# EasyEDA schematic SCH_Iris_OnBoardSystem.json
TITLE: On Board Controller w/ all Arduino Pins Exposed; REV: 1.4; Date: 2023-06-11; Sheet: 1/2; Drawn By: markos.delaportas; Company: ASPiRE
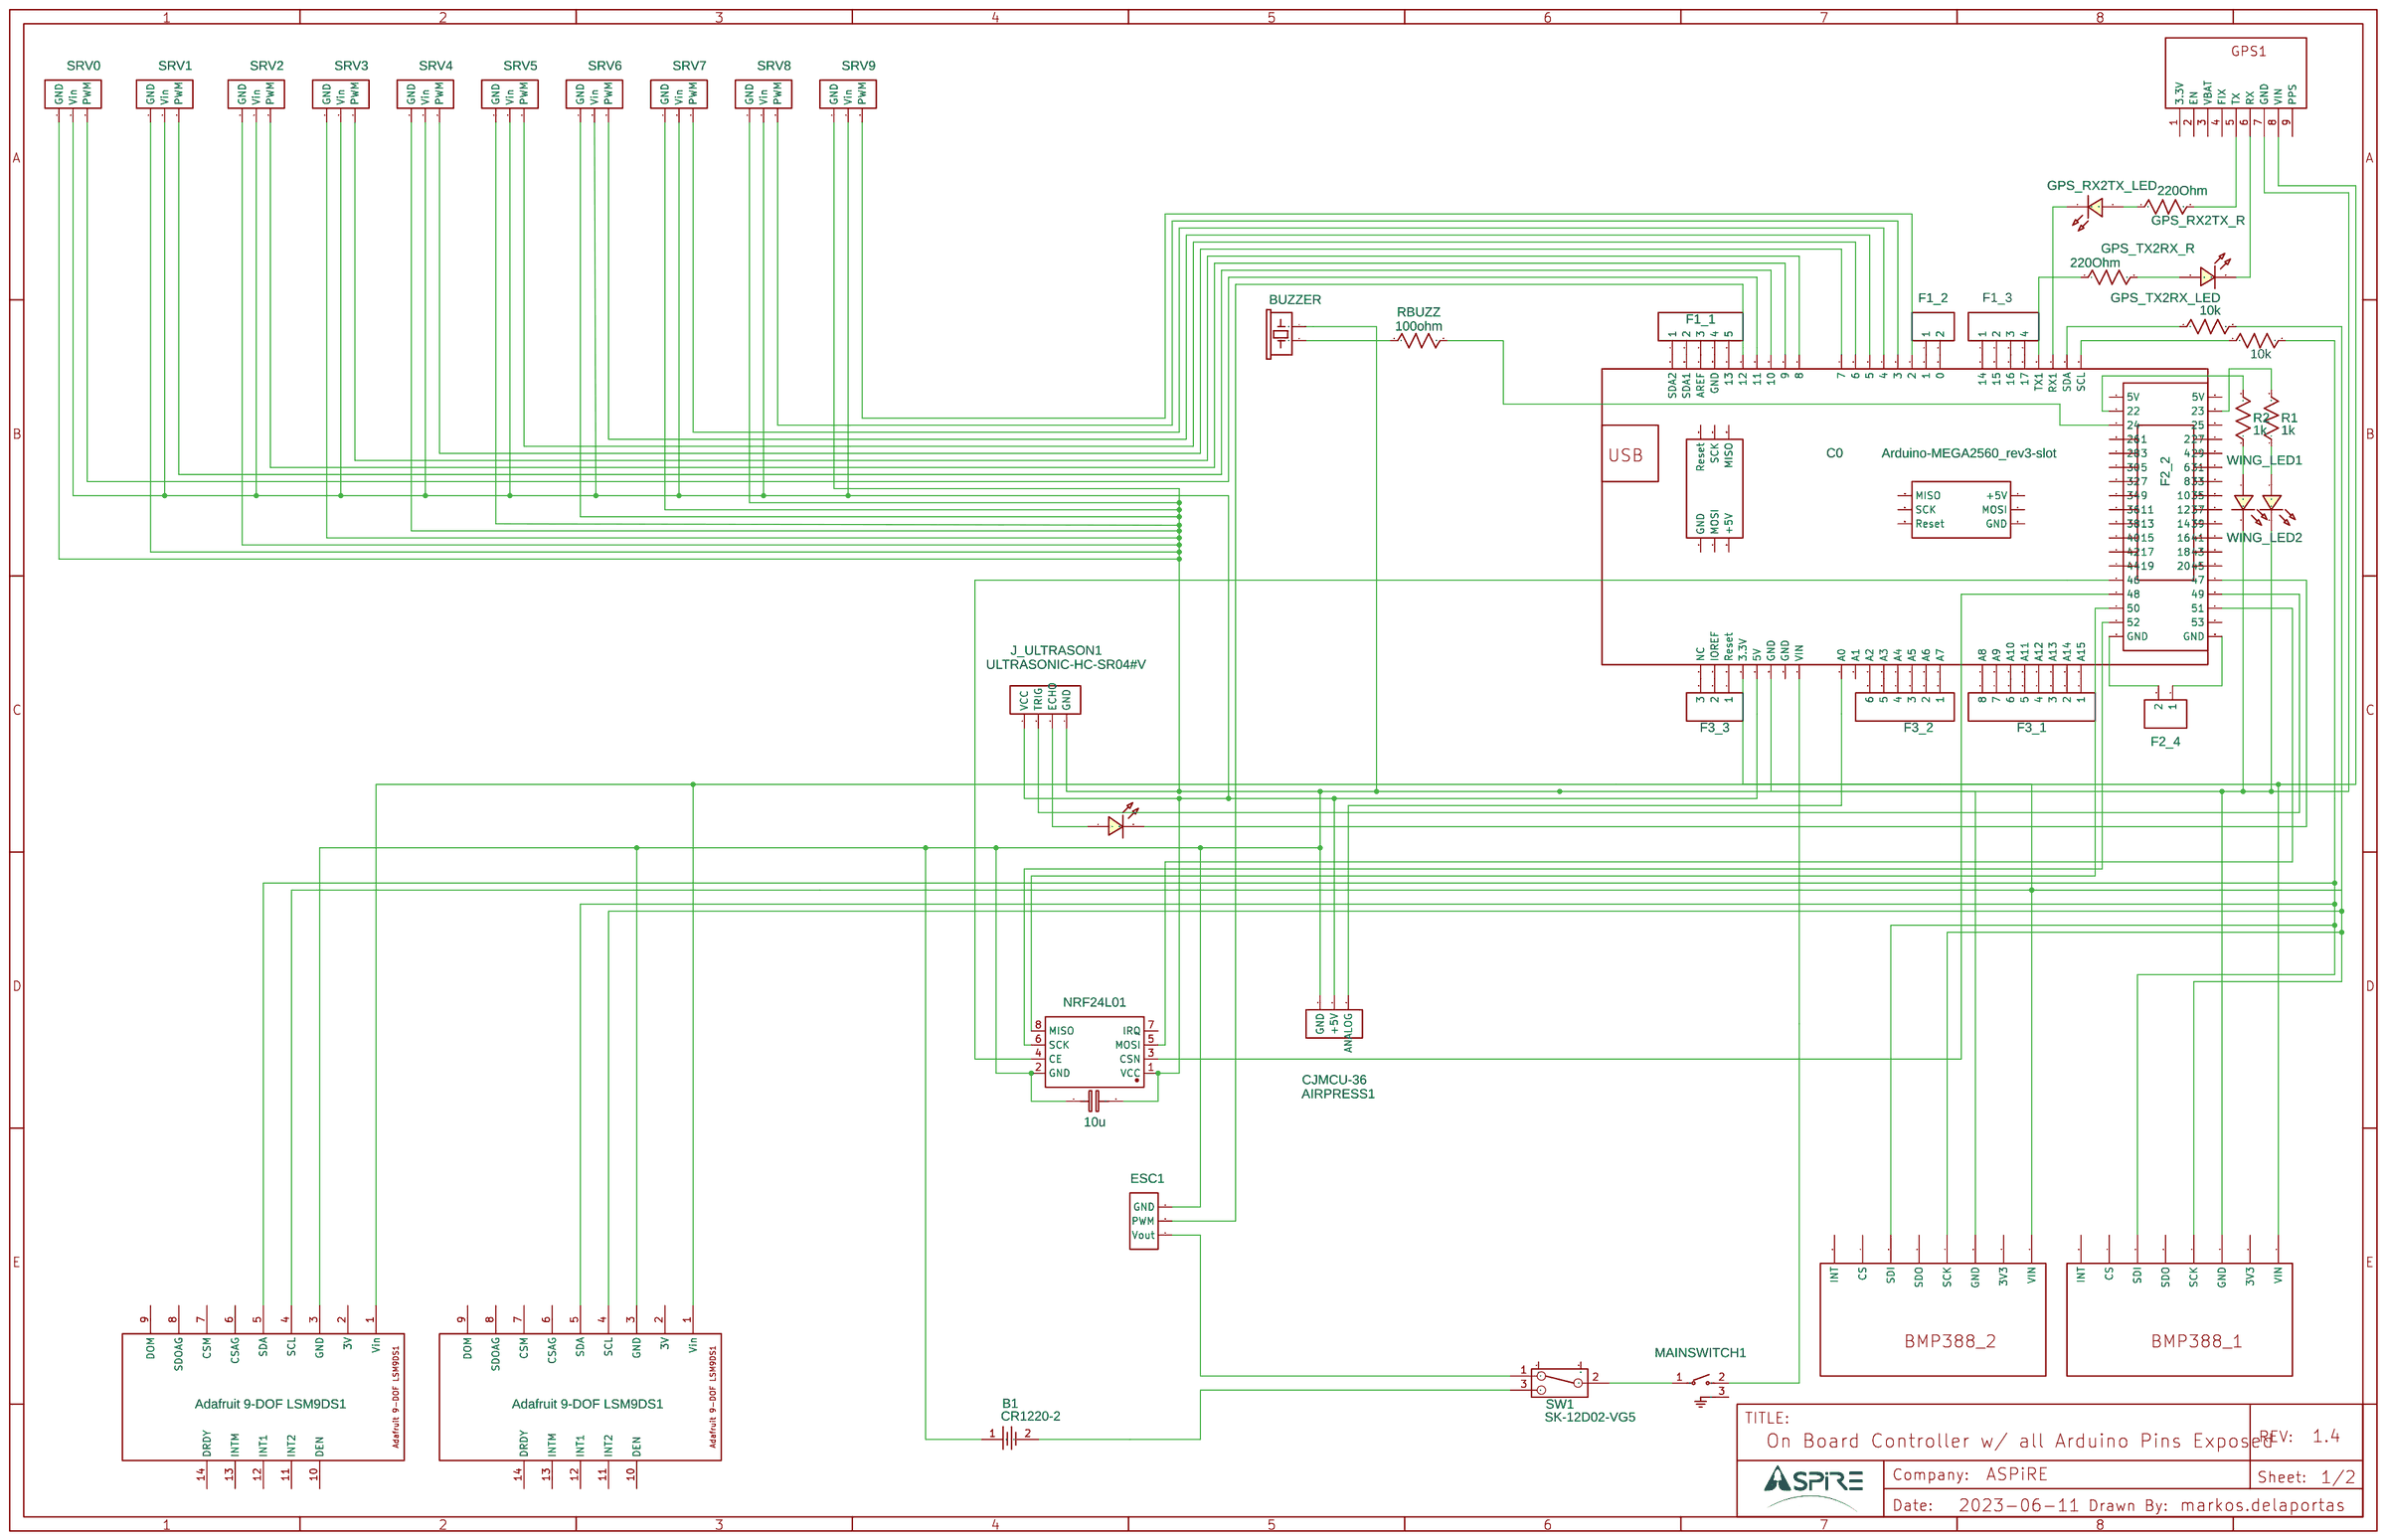
[diagram p0: schematic sheet]

## Parts
AIRPRESS1  CJMCU-36  [HDR-M-2.54_1X3]
B1  CR1220-2  [BAT-SMD_CR1220-2]
BUZZER  BUZZER-PTH_NO_SILK  [BUZZER-12MM-NS]
C0  Arduino-MEGA2560_rev3-slot  [ARDUINO-MEGA2560_REV3-SLOT-FOOTPRINT]
C1_2  10u  [RAD-0.1]
ESC1  ESC  [HDR-M-2.54_1X3]
F1_1  HDR-F-2.54_1x5  [HDR-F-2.54_1X5]
F1_2  HDR-F-2.54_1x2  [HDR-F-2.54_1X2]
F1_3  HDR-F-2.54_1x4  [HDR-F-2.54_1X4]
F2_2  HDR-F-2.54_2x10  [HDR-F-2.54_2X10]
F2_4  HDR-F-2.54_1x2  [HDR-F-2.54_1X2]
F3_1  HDR-F-2.54_1x8  [HDR-F-2.54_1X8]
F3_2  HDR-F-2.54_1x6  [HDR-F-2.54_1X6]
F3_3  HDR-F-2.54_1x3  [HDR-F-2.54_1X3]
GPS2  ULTIMATE GPS MODULE  [ADAFRUIT ULTIMATE GPS BREAKOUT V3]
GPS_RX2TX_LED  LED-TH-5mm_R  [LED-TH_BD5.0_RED]
GPS_RX2TX_R  220Ohm  [R_AXIAL-0.3]
GPS_TX2RX_LED  LED-TH-5mm_B  [LED-TH_BD5.0_BLUE]
GPS_TX2RX_R  220Ohm  [R_AXIAL-0.3]
J_ULTRASON1  ULTRASONIC-HC-SR04#V  [HDR-M-2.54_1X4]
LED1_2  LED-TH-3mm_R  [LED-TH_BD3.0_RED]
MAINSWITCH1  GT-TCB73B-H090-L1  [SW-TH_G-SWITCH_GT-TCB73B-H090-L1]
MK2  NRF24L01  [WIRELM-SMD_NRF24L01]
R1  1k  [R_AXIAL-0.3]
R1_2  1k  [R_AXIAL-0.4]
R2  1k  [R_AXIAL-0.3]
R2_2  10k  [R_AXIAL-0.4]
RBUZZ  100ohm  [R_AXIAL-0.3]
SRV0  HDR-M-2.54_1x3  [HDR-M-2.54_1X3]
SRV1  HDR-M-2.54_1x3  [HDR-M-2.54_1X3]
SRV2  HDR-M-2.54_1x3  [HDR-M-2.54_1X3]
SRV3  HDR-M-2.54_1x3  [HDR-M-2.54_1X3]
SRV4  HDR-M-2.54_1x3  [HDR-M-2.54_1X3]
SRV5  HDR-M-2.54_1x3  [HDR-M-2.54_1X3]
SRV6  HDR-M-2.54_1x3  [HDR-M-2.54_1X3]
SRV7  HDR-M-2.54_1x3  [HDR-M-2.54_1X3]
SRV8  HDR-M-2.54_1x3  [HDR-M-2.54_1X3]
SRV9  HDR-M-2.54_1x3  [HDR-M-2.54_1X3]
SW1  SK-12D02-VG5  [SW-TH_SK-12D02VG3]
U2  Adafruit 9-DOF LSM9DS1  [ADAFRUIT 9-DOF LSM9DS1]
U3  Adafruit 9-DOF LSM9DS1  [ADAFRUIT 9-DOF LSM9DS1]
U6  ADAFRUIT_BMP388_2  [ADAFRUIT BMP388 BOARD]
U7  ADAFRUIT_BMP388_1  [ADAFRUIT BMP388 BOARD]
WING_LED1  LED-TH-5mm_G  [LED-TH_BD5.0_GREEN]
WING_LED2  LED-TH-5mm_G  [LED-TH_BD5.0_GREEN]

## Library data of the parts
AIRPRESS1 ESC1 SRV0-SRV9 = HDR-M-2.54_1x3: Supplier Part: C180248; Supplier: LCSC; Contributor: LCEDA_Lib
B1 = CR1220-2: Supplier: LCSC; Manufacturer: Q&J; image: //image.lceda.cn/szlcsc/C70381.jpg; Supplier Part: C70381
BUZZER = BUZZER-PTH_NO_SILK: Contributor: Octoco
C0 = Arduino-MEGA2560_rev3-slot: Contributor: jakubT21
C1_2 = C_RAD-0.1_EU: Contributor: LCEDA_Lib
F1_1 = HDR-F-2.54_1x5: Supplier Part: C50950; Supplier: LCSC; Contributor: LCEDA_Lib
F1_2 F2_4 = HDR-F-2.54_1x2: Supplier Part: C49661; Supplier: LCSC; Contributor: LCEDA_Lib
F1_3 = HDR-F-2.54_1x4: Supplier Part: C225501; Supplier: LCSC; Contributor: LCEDA_Lib
F2_2 = HDR-F-2.54_2x10: Supplier Part: C30867; Supplier: LCSC; Contributor: LCEDA_Lib
F3_1 = HDR-F-2.54_1x8: Supplier Part: C225505; Supplier: LCSC; Contributor: LCEDA_Lib
F3_2 = HDR-F-2.54_1x6: Supplier Part: C40877; Supplier: LCSC; Contributor: LCEDA_Lib
F3_3 = HDR-F-2.54_1x3: Supplier Part: C146690; Supplier: LCSC; Contributor: LCEDA_Lib
GPS2 = ULTIMATE GPS MODULE: Manufacturer: Crydom; Manufacturer Part: Solid State Relays; Supplier Part: 746; Supplier: Adafruit; link: https://www.adafruit.com/product/746; Contributor: otisbyron
GPS_RX2TX_LED = LED-TH-5mm_R: Manufacturer: EVERLIGHT(台湾亿光); Manufacturer Part: 333-2SURD/S530-A3; Supplier Part: C87271; Supplier: LCSC; Contributor: LCEDA_Lib
GPS_RX2TX_R GPS_TX2RX_R R1 R2 RBUZZ = R_AXIAL-0.3_US: Contributor: LCEDA_Lib
GPS_TX2RX_LED = LED-TH-5mm_B: Supplier: LCSC; Contributor: LCEDA_Lib
J_ULTRASON1 = HDR-M-2.54_1x4: Supplier Part: C124378; Supplier: LCSC; Contributor: LCEDA_Lib
LED1_2 = LED-TH-3mm_R: Manufacturer: EVERLIGHT(台湾亿光); Manufacturer Part: 204-10SDRD/S530-A3-L; Supplier Part: C84774; Supplier: LCSC; Contributor: LCEDA_Lib
MAINSWITCH1 = GT-TCB73B-H090-L1: Supplier: LCSC; Supplier Part: C2890355; Manufacturer: G-Switch(品赞); Contributor: LCSC; JLCPCB Part Class: Extended Part
MK2 = NRF24L01: Supplier: LCSC; Manufacturer: Ai-Thinker(安信可); Manufacturer Part: NF-04; Supplier Part: C90751; JLCPCB Part Class: Extended Part
R1_2 R2_2 = R_AXIAL-0.4_US: Contributor: LCEDA_Lib
SW1 = SK-12D02-VG5: Supplier: LCSC; Supplier Part: C136722; Manufacturer: Rectangular Connectors - Contacts; Contributor: LCSC
U2 U3 = Adafruit 9-DOF LSM9DS1: Manufacturer: Adafruit; Manufacturer Part: 4634; Supplier: Core Electronics; Supplier Part: ADA4634; Contributor: pyr0boy
U6 U7 = ADAFRUIT BMP388 BOARD COPY: Manufacturer: Bosch; Manufacturer Part: BMP388; Supplier: Adafruit; Supplier Part: 3966; link: https://www.adafruit.com/product/3966; Contributor: joshgarde
WING_LED1 WING_LED2 = LED-TH-5mm_G: Manufacturer: EVERLIGHT(台湾亿光); Manufacturer Part: 333-2SYGD/S530-E2; Supplier Part: C88163; Supplier: LCSC; Contributor: LCEDA_Lib

## Nets
Net-(AIRPRESS1-1): AIRPRESS1.1(ANALOG) C0.A0
Net-(AIRPRESS1-2): AIRPRESS1.2(+5V) C0.5V C1_2.2 J_ULTRASON1.1(VCC) MK2.1(VCC) SRV0.2(Vin) SRV1.2(Vin) SRV2.2(Vin) SRV3.2(Vin) SRV4.2(Vin) SRV5.2(Vin) SRV6.2(Vin) SRV7.2(Vin) SRV8.2(Vin) SRV9.2(Vin)
Net-(AIRPRESS1-3): AIRPRESS1.3(GND) B1.1 BUZZER.-(2) C1_2.1 ESC1.3(GND) GPS2.7(GND) J_ULTRASON1.4(GND) MK2.2(GND) SRV0.1(GND) SRV1.1(GND) SRV2.1(GND) SRV3.1(GND) SRV4.1(GND) SRV5.1(GND) SRV6.1(GND) SRV7.1(GND) SRV8.1(GND) SRV9.1(GND) U2.3(GND) U3.3(GND) U7.3(GND) WING_LED1.2 WING_LED2.2
Net-(B1-2): B1.2 SW1.3
Net-(BUZZER-+): BUZZER.+(1) RBUZZ.1
Net-(C0-0): C0.0 F1_2.2
Net-(C0-1): C0.1 F1_2.1
Net-(C0-2): C0.2 SRV9.3(PWM)
Net-(C0-3): C0.3 SRV8.3(PWM)
Net-(C0-3.3V): C0.3.3V R2_2.2 U2.4(SCL) U3.4(SCL) U6.1(VIN) U6.4(SCK) U7.4(SCK)
Net-(C0-4): C0.4 SRV7.3(PWM)
Net-(C0-5): C0.5 SRV6.3(PWM)
Net-(C0-6): C0.6 SRV5.3(PWM)
Net-(C0-7): C0.7 SRV4.3(PWM)
Net-(C0-8): C0.8 SRV3.3(PWM)
Net-(C0-9): C0.9 SRV2.3(PWM)
Net-(C0-10): C0.10 SRV1.3(PWM)
Net-(C0-11): C0.11 SRV0.3(PWM)
Net-(C0-12): C0.12 ESC1.2(PWM)
Net-(C0-13): C0.13 F1_1.5
Net-(C0-14): C0.14 F1_3.1
Net-(C0-15): C0.15 F1_3.2
Net-(C0-16): C0.16 F1_3.3
Net-(C0-17): C0.17 F1_3.4
Net-(C0-18): C0.18(TX1) GPS_TX2RX_R.1
Net-(C0-19): C0.19(RX1) GPS_RX2TX_LED.2
Net-(C0-20): C0.20(SDA) R2_2.1
Net-(C0-21): C0.21(SCL) R1_2.1
Net-(C0-22): C0.22 R2.2
Net-(C0-23): C0.23 R1.2
Net-(C0-24): C0.24 RBUZZ.2
Net-(C0-26): C0.26 F2_2.1
Net-(C0-27): C0.27 F2_2.2
Net-(C0-28): C0.28 F2_2.3
Net-(C0-29): C0.29 F2_2.4
Net-(C0-30): C0.30 F2_2.5
Net-(C0-31): C0.31 F2_2.6
Net-(C0-32): C0.32 F2_2.7
Net-(C0-33): C0.33 F2_2.8
Net-(C0-34): C0.34 F2_2.9
Net-(C0-35): C0.35 F2_2.10
Net-(C0-36): C0.36 F2_2.11
Net-(C0-37): C0.37 F2_2.12
Net-(C0-38): C0.38 F2_2.13
Net-(C0-39): C0.39 F2_2.14
Net-(C0-40): C0.40 F2_2.15
Net-(C0-41): C0.41 F2_2.16
Net-(C0-42): C0.42 F2_2.17
Net-(C0-43): C0.43 F2_2.18
Net-(C0-44): C0.44 F2_2.19
Net-(C0-45): C0.45 F2_2.20
Net-(C0-46): C0.46 MK2.4(CE)
Net-(C0-47): C0.47 LED1_2.2
Net-(C0-48): C0.48 MK2.3(CSN)
Net-(C0-49): C0.49 J_ULTRASON1.2(TRIG)
Net-(C0-50): C0.50 MK2.8(MISO)
Net-(C0-51): C0.51 MK2.5(MOSI)
Net-(C0-52): C0.52 MK2.6(SCK)
Net-(C0-87): C0.87(NC) F3_3.3
Net-(C0-A2): C0.A2 F3_2.6
Net-(C0-A3): C0.A3 F3_2.5
Net-(C0-A4): C0.A4 F3_2.4
Net-(C0-A5): C0.A5 F3_2.3
Net-(C0-A6): C0.A6 F3_2.2
Net-(C0-A7): C0.A7 F3_2.1
Net-(C0-A8): C0.A8 F3_1.8
Net-(C0-A9): C0.A9 F3_1.7
Net-(C0-A10): C0.A10 F3_1.6
Net-(C0-A11): C0.A11 F3_1.5
Net-(C0-A12): C0.A12 F3_1.4
Net-(C0-A13): C0.A13 F3_1.3
Net-(C0-A14): C0.A14 F3_1.2
Net-(C0-A15): C0.A15 F3_1.1
Net-(C0-AREF): C0.AREF F1_1.3
Net-(C0-GND..): C0.GND..(GND) U6.3(GND)
Net-(C0-GND...): C0.GND...(GND) F2_4.2
Net-(C0-GND....): C0.GND....(GND) F2_4.1
Net-(C0-GND.....): C0.GND.....(GND) F1_1.4
Net-(C0-IOREF): C0.IOREF F3_3.2
Net-(C0-RST): C0.RST(Reset) F3_3.1
Net-(C0-SDA1): C0.SDA1 F1_1.2
Net-(C0-SDA2): C0.SDA2 F1_1.1
Net-(C0-VIN): C0.VIN MAINSWITCH1.2
Net-(ESC1-1): ESC1.1(Vout) SW1.1
Net-(GPS2-5): GPS2.5(TX) GPS_RX2TX_R.2
Net-(GPS2-6): GPS2.6(RX) GPS_TX2RX_LED.2
Net-(GPS2-8): GPS2.8(VIN) U2.1(Vin) U3.1(Vin) U7.1(VIN)
Net-(GPS_RX2TX_LED-1): GPS_RX2TX_LED.1 GPS_RX2TX_R.1
Net-(GPS_TX2RX_LED-1): GPS_TX2RX_LED.1 GPS_TX2RX_R.2
Net-(J_ULTRASON1-3): J_ULTRASON1.3(ECHO) LED1_2.1
Net-(MAINSWITCH1-1): MAINSWITCH1.1 SW1.2
Net-(R1-1): R1.1 WING_LED1.1
Net-(R1_2-2): R1_2.2 U2.5(SDA) U3.5(SDA) U6.6(SDI) U7.6(SDI)
Net-(R2-1): R2.1 WING_LED2.1

Not connected (* = marked no-connect by the designer): C0 5V.(5V) 5V..(5V) 25 53 +5V_(+5V) +5V_2(+5V) A1 GND.(GND) GND_(GND) GND_2(GND) MISO MISO2(MISO) MOSI MOSI2(MOSI) RESET2(Reset) RESET_(Reset) SCK SCK2(SCK); GPS2 1(3.3V) 2(EN) 3(VBAT) 4(FIX) 9(PPS); MAINSWITCH1 3; MK2 7(IRQ); SW1 4 5; U2 2(3V) 6(CSAG) 7(CSM) 8(SDOAG) 9(DOM) 10(DEN) 11(INT2) 12(INT1) 13(INTM) 14(DRDY); U3 2(3V) 6(CSAG) 7(CSM) 8(SDOAG) 9(DOM) 10(DEN) 11(INT2) 12(INT1) 13(INTM) 14(DRDY); U6 2(3V3) 5(SDO) 7(CS) 8(INT); U7 2(3V3) 5(SDO) 7(CS) 8(INT)

## Notes on the sheet
- F1_3
- 10k
